# Altium schematic sheet 358MU&IZNWBYTU20260630.SchDoc
size 594 x 419 mm
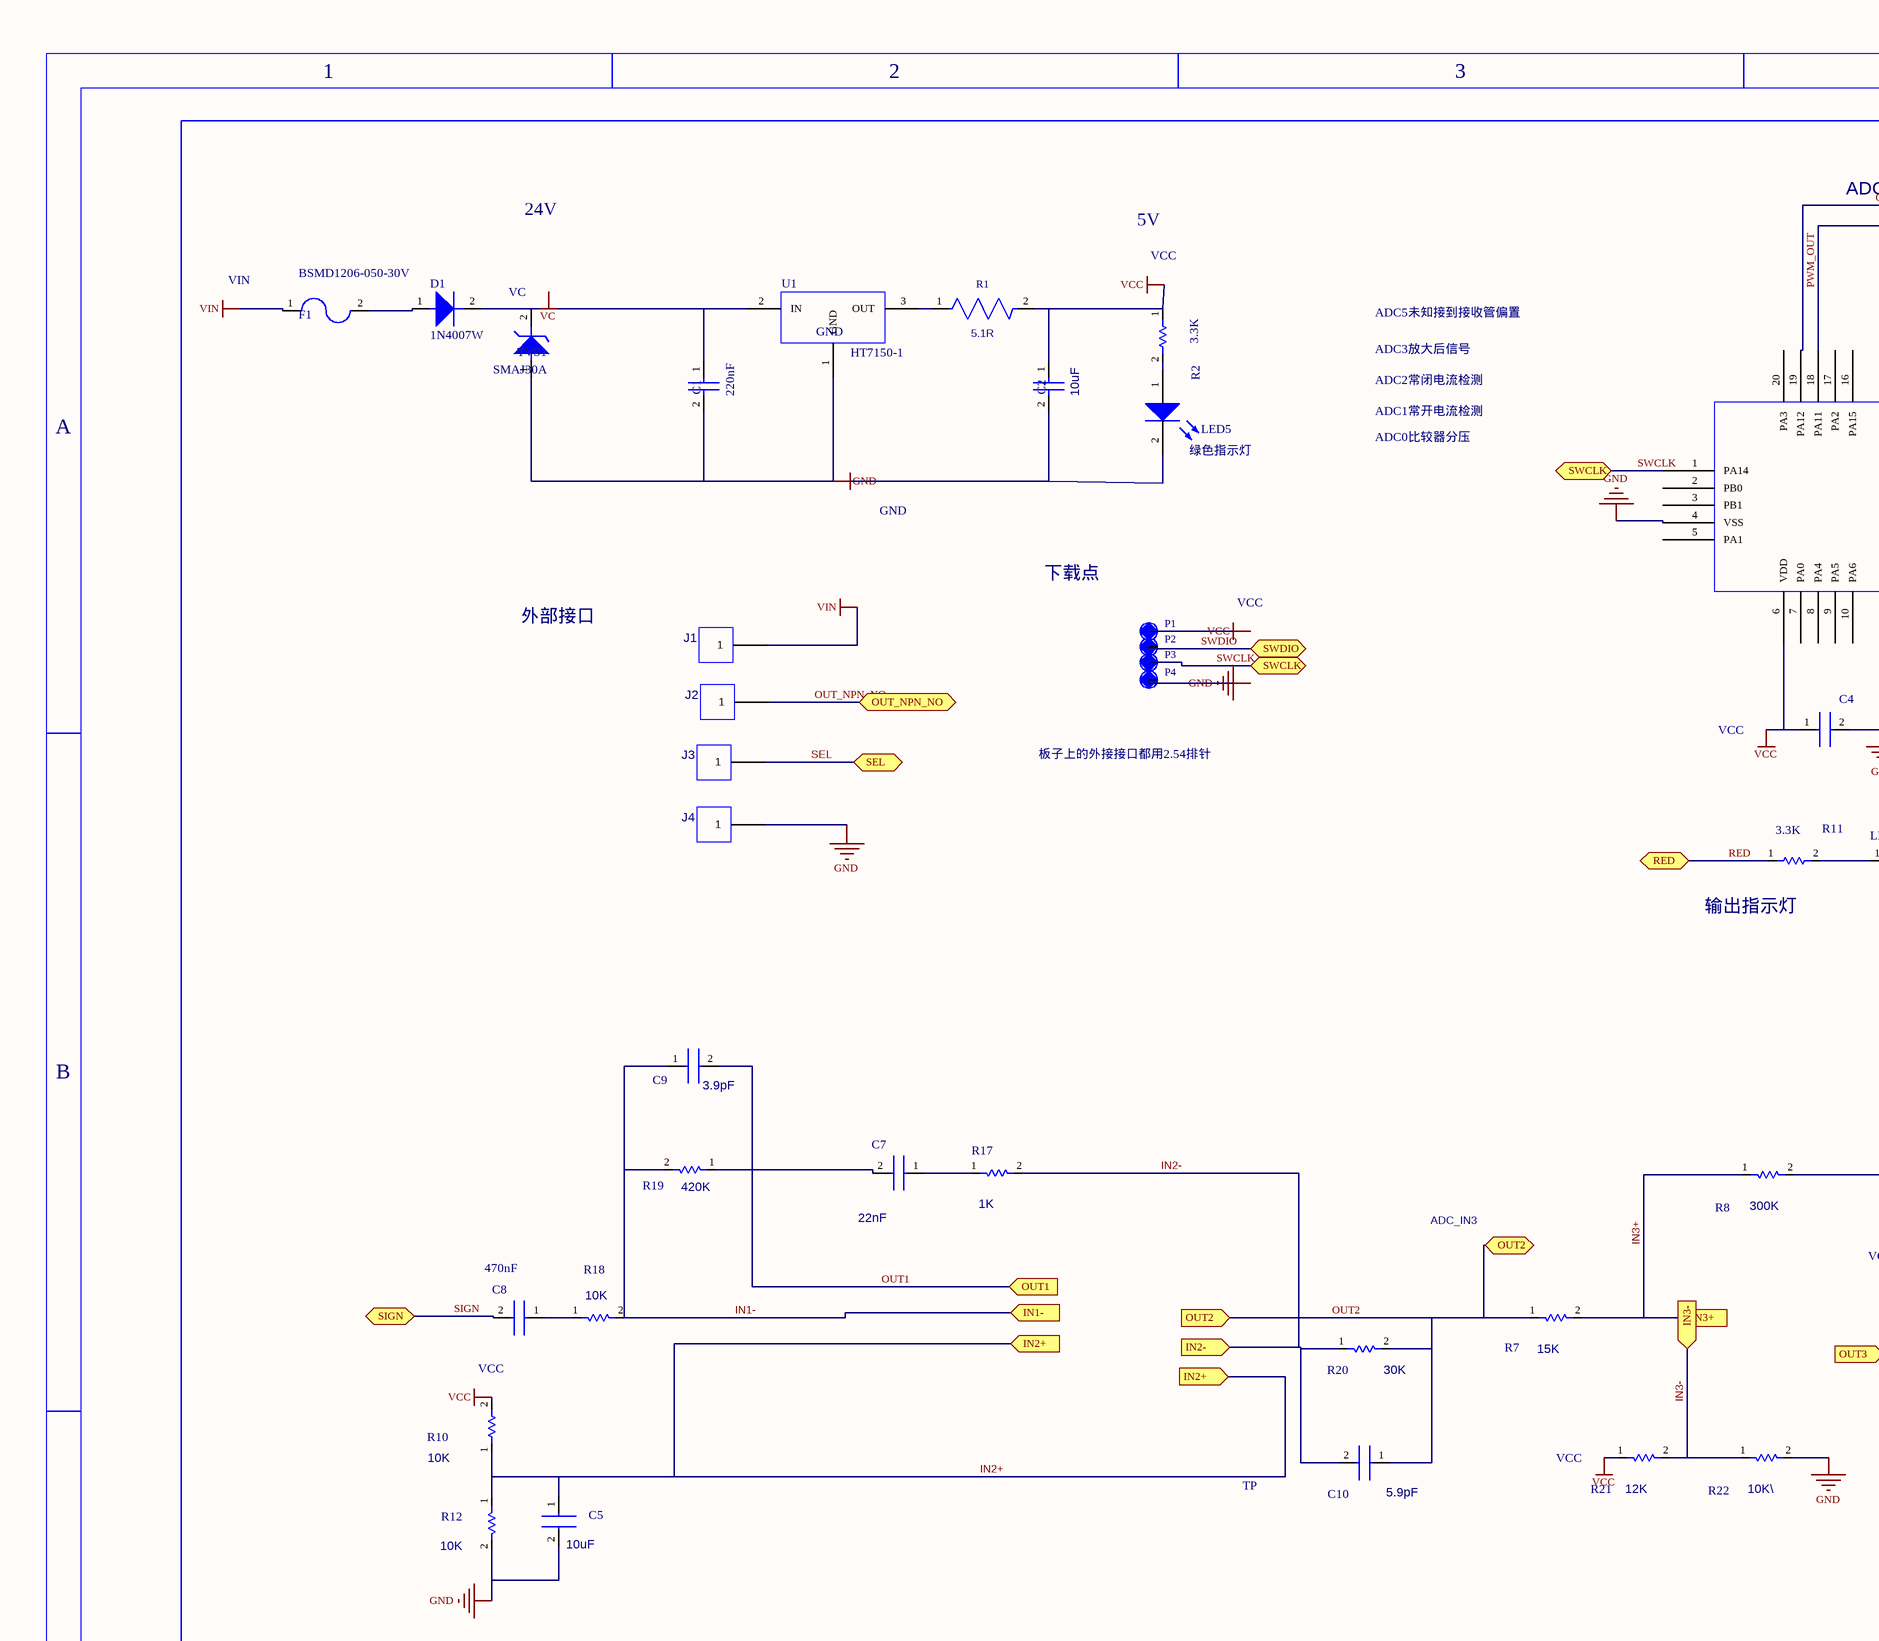
[diagram p0: 358MU&IZNWBYTU20260630.SchDoc, top left]
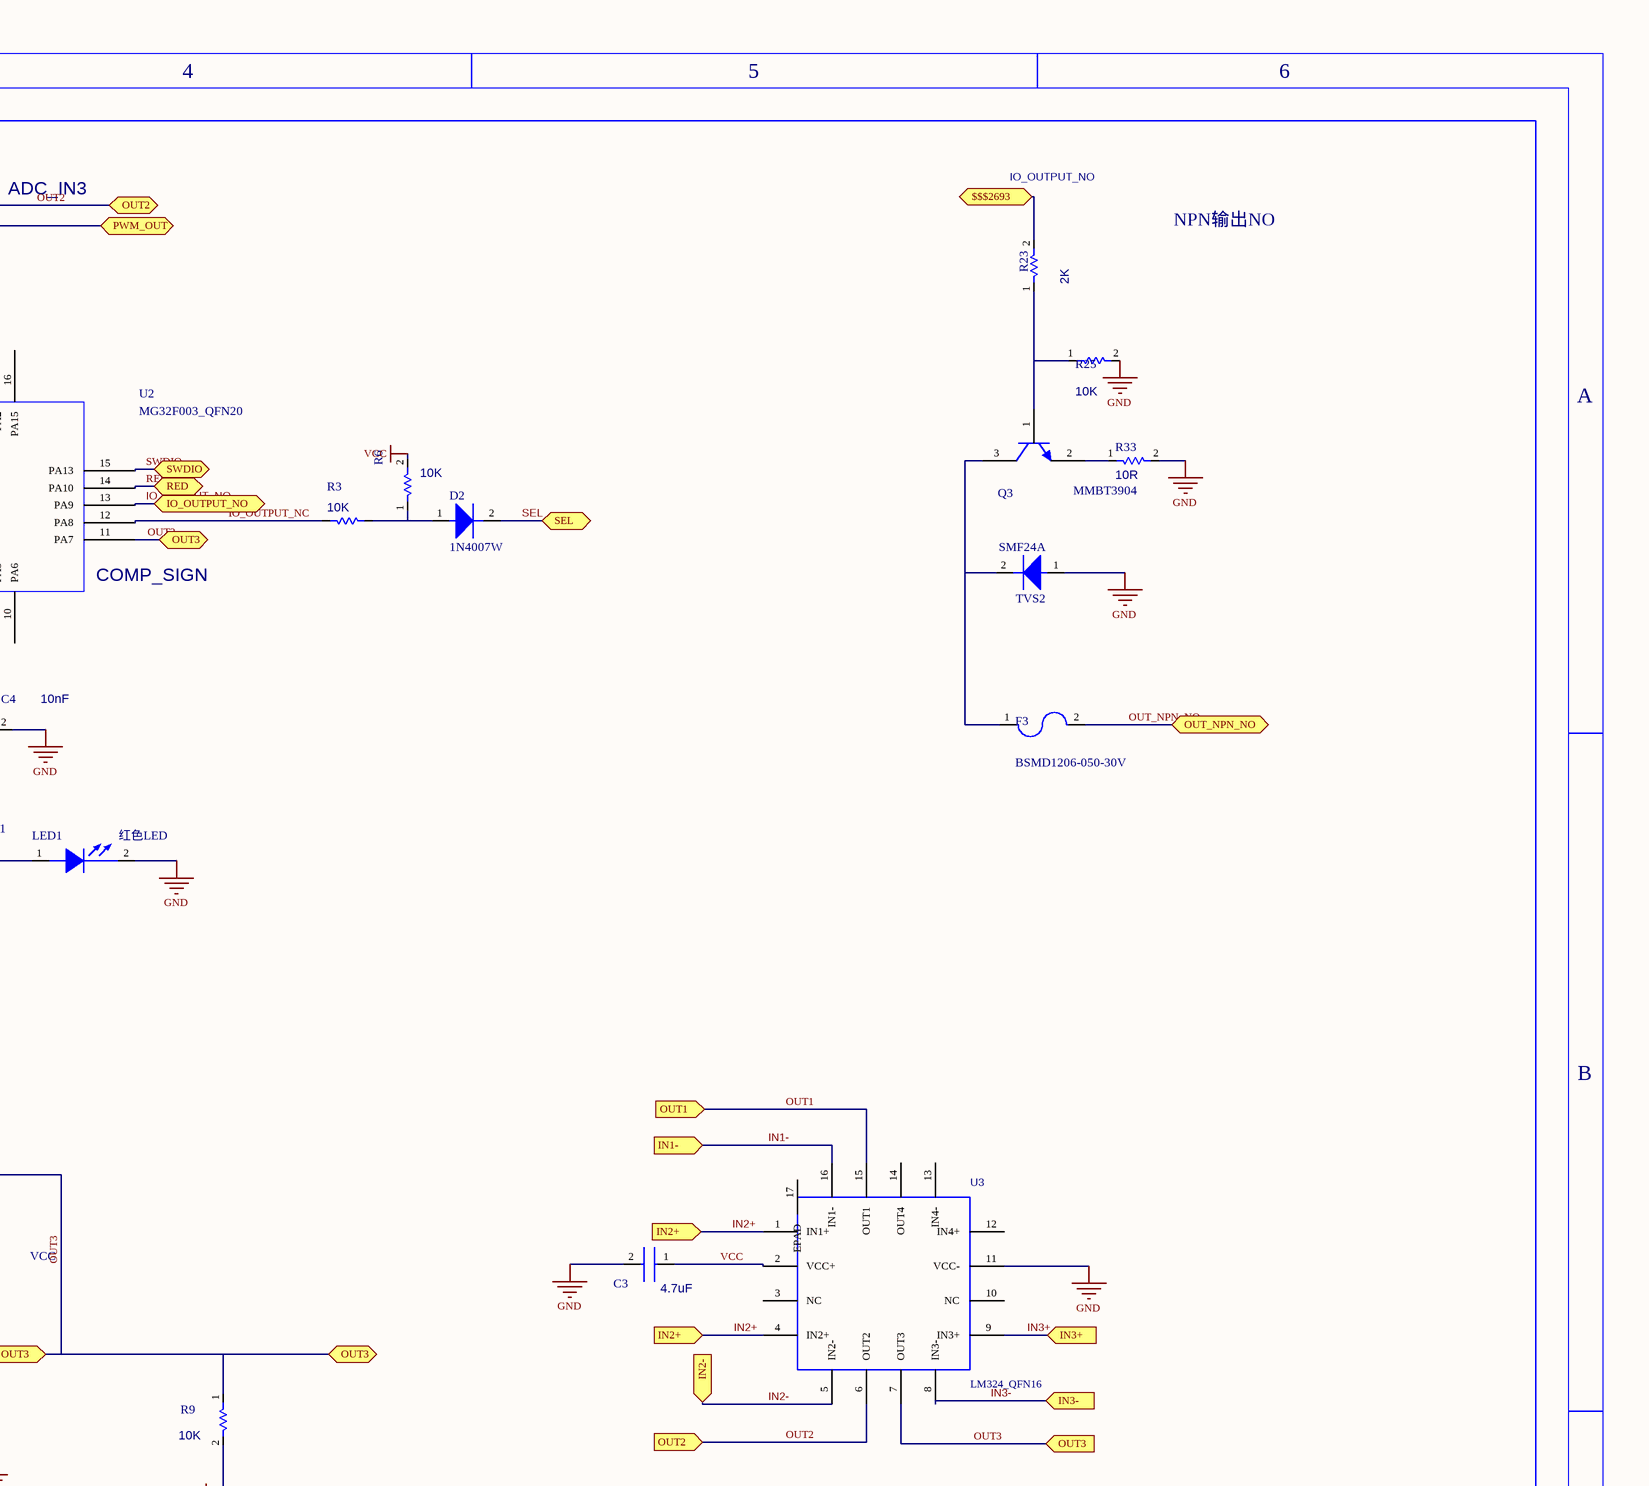
[diagram p1: 358MU&IZNWBYTU20260630.SchDoc, top right]
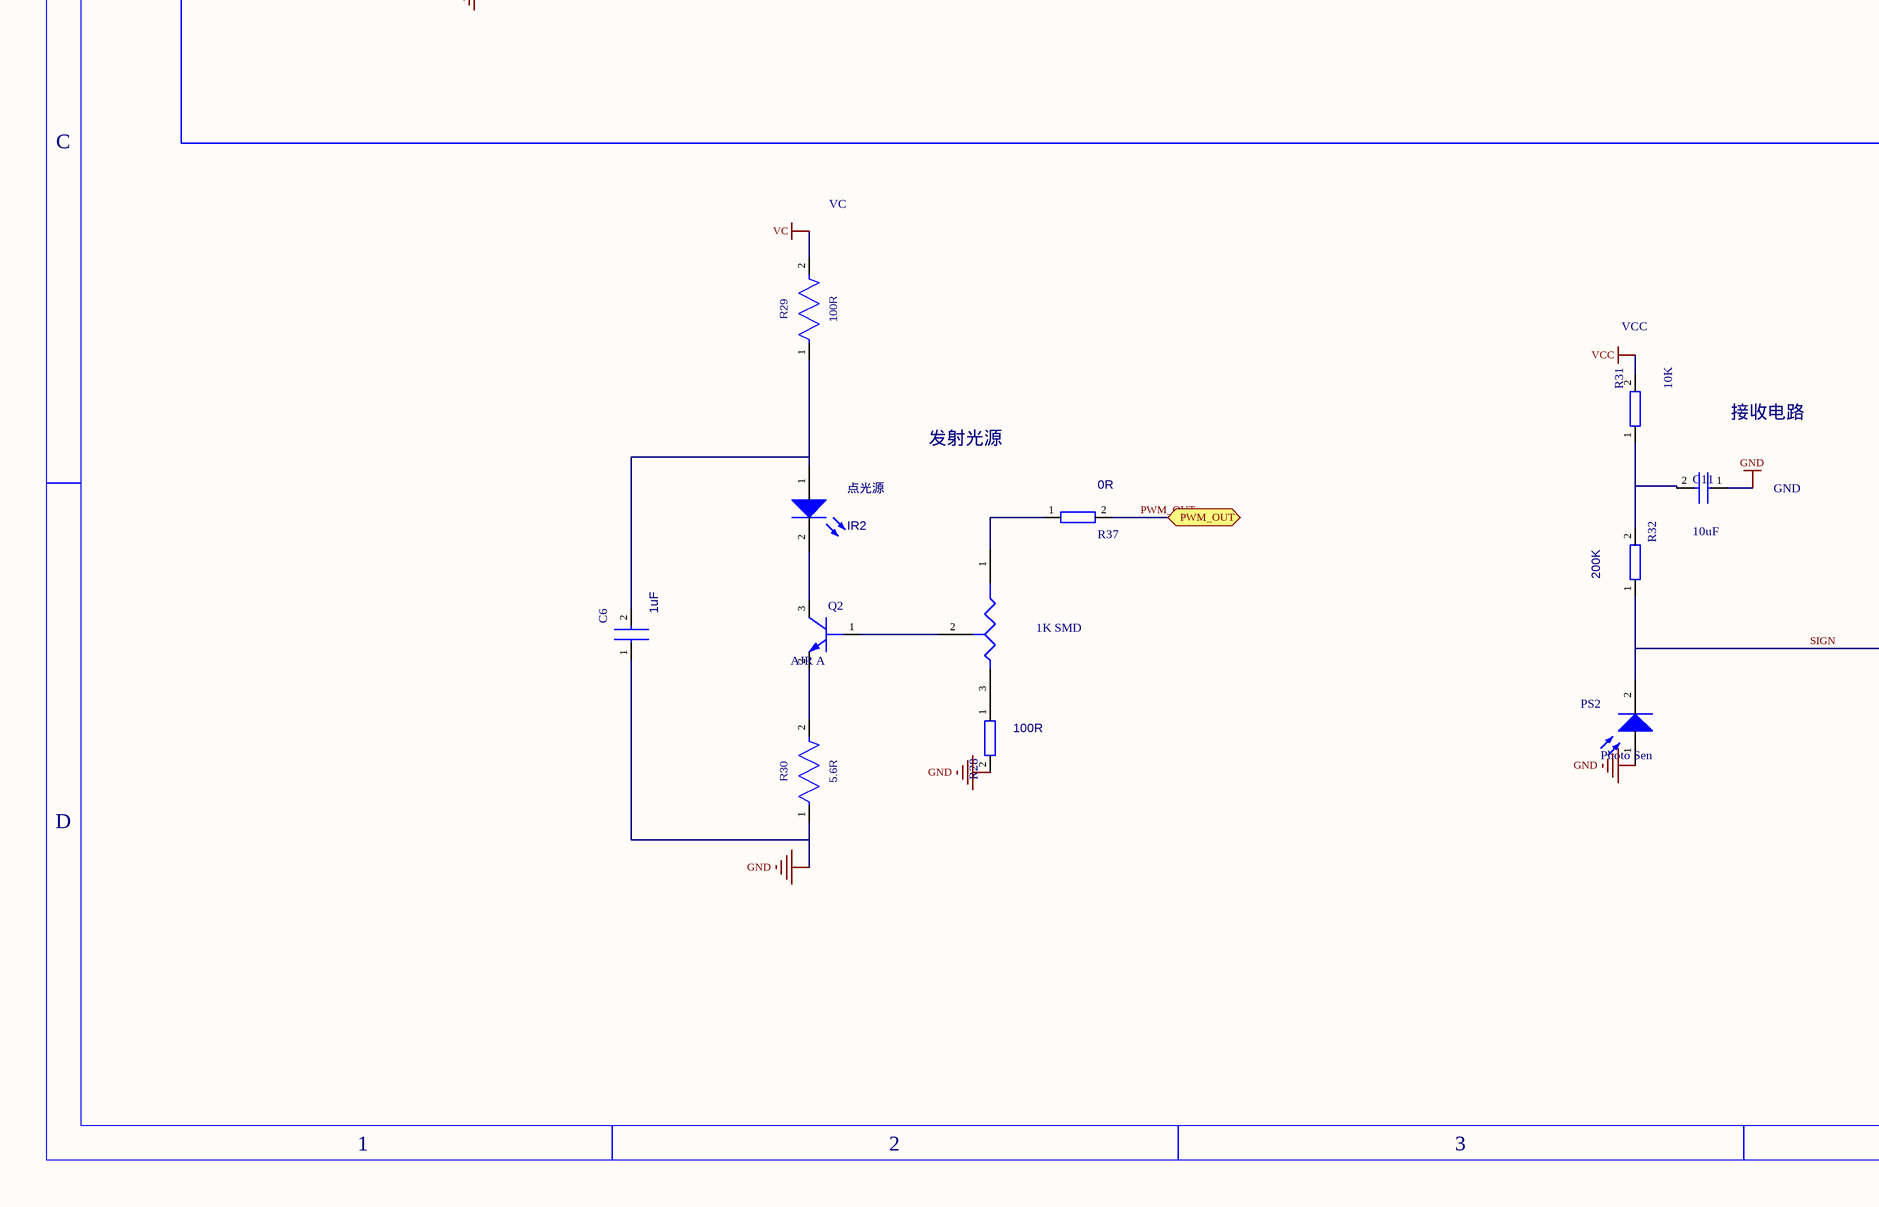
[diagram p2: 358MU&IZNWBYTU20260630.SchDoc, bottom left]
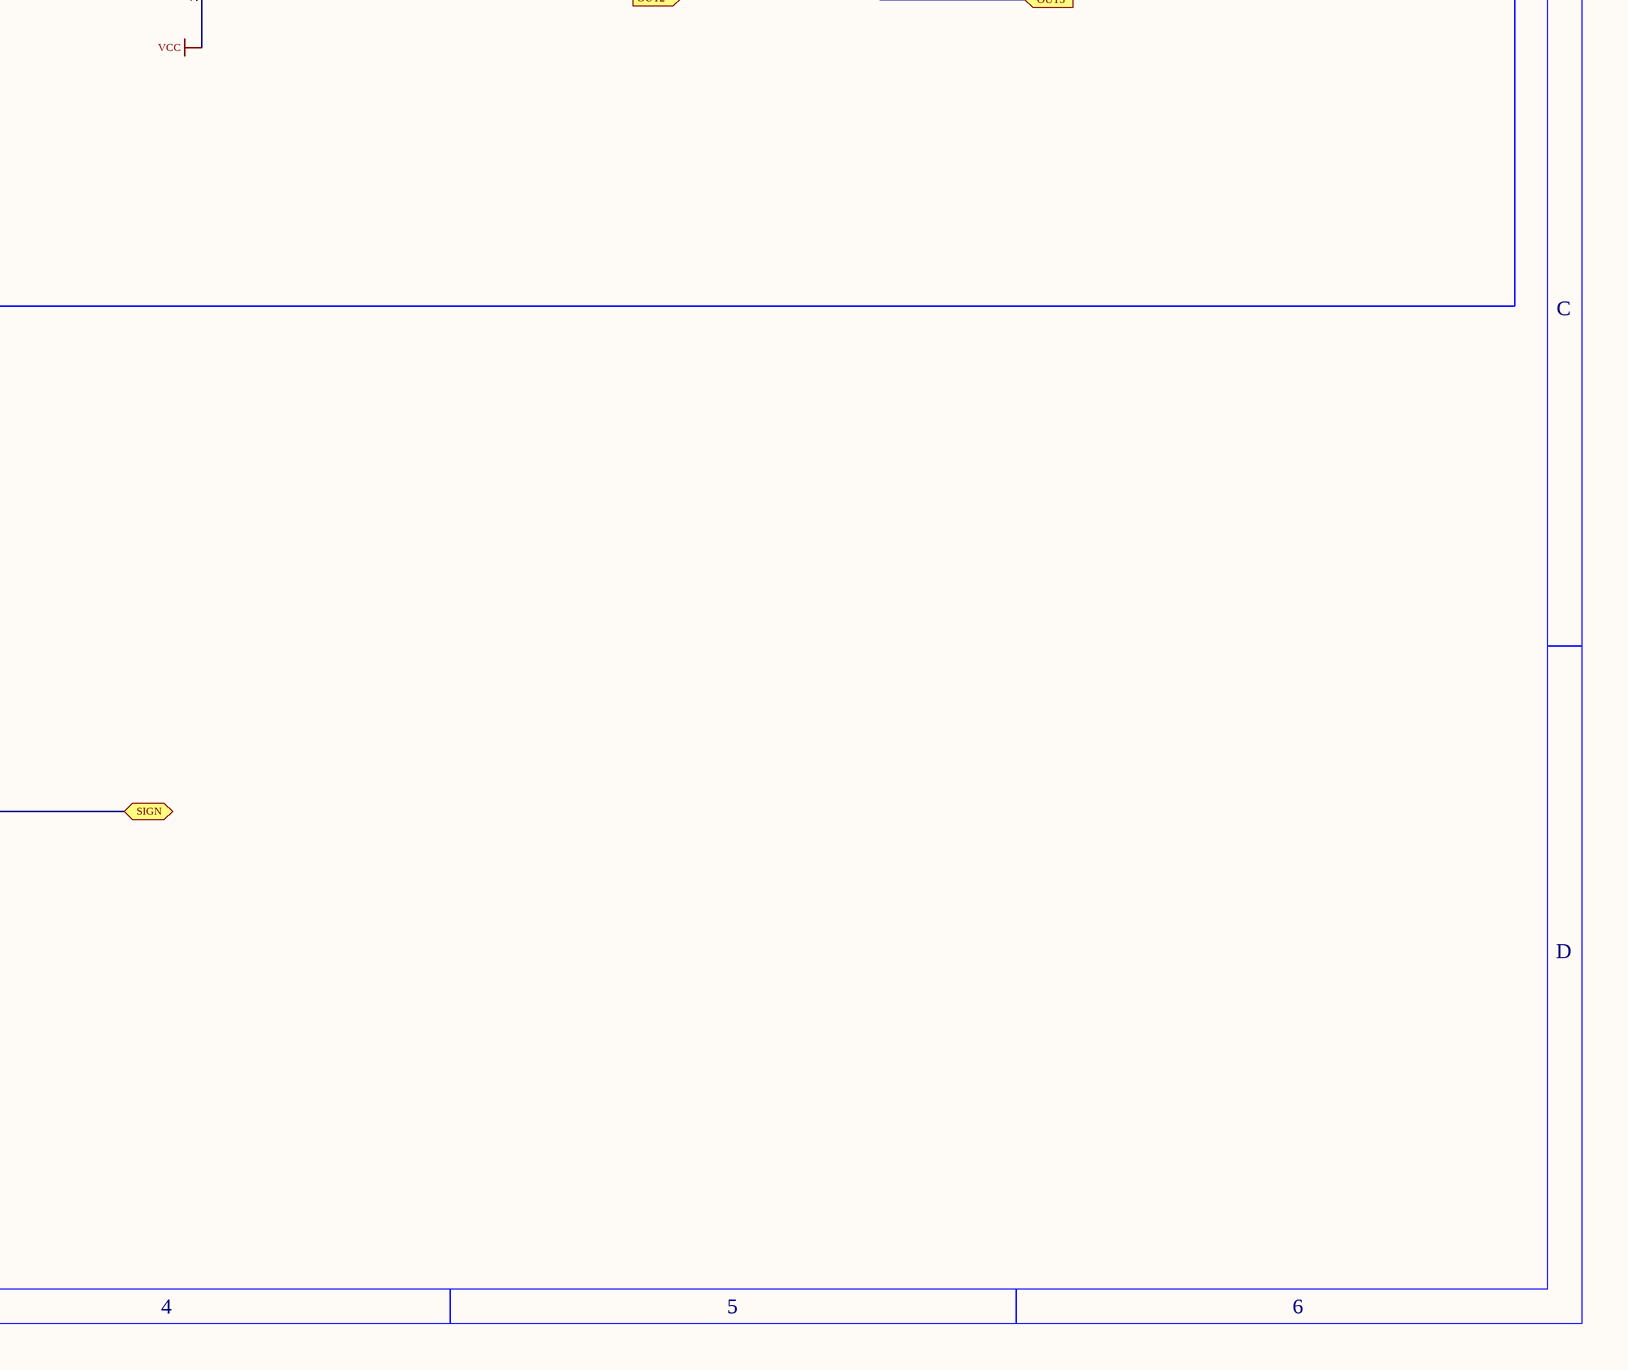
[diagram p3: 358MU&IZNWBYTU20260630.SchDoc, bottom right]

## Parts
C1  CAP  [C0603]  (value not drawn)
C2  CAP  [C0603]  (value not drawn)
C3  CAP_2  [C0603]  (value not drawn)
C4  CAP0402  [CC0402]  (value not drawn)
C5  CAP_2  [C0603]  (value not drawn)
C6  CAP0603  [0603C]  (value not drawn)
C7  CAP0402  [CC0402]  (value not drawn)
C8  CAP0402  [CC0402]  (value not drawn)
C9  CAP0402  [CC0402]  (value not drawn)
C10  CAP0402  [CC0402]  (value not drawn)
C11  CAP_NP  [0603]  (value not drawn)
D1  DIODE  [WSOD-323]  (value not drawn)
D2  DIODE  [WSOD-323]  (value not drawn)
F1  FUSE  [0603]  (value not drawn)
F3  FUSE  [0603]  (value not drawn)
IR2  LED0  [TXLED_SMD]  (value not drawn)
J1  FPAD_3C  [FPAD_3C]  (value not drawn)
J2  FPAD_3C  [FPAD_3C]  (value not drawn)
J3  FPAD_3C  [FPAD_3C]  (value not drawn)
J4  FPAD_3C  [FPAD_3C]  (value not drawn)
LED1  LED  [LED0603]  (value not drawn)
LED5  LED2  [LED0603]  (value not drawn)
P1  TEST_POINTB+  [TEST-POINT_D1.0]  (value not drawn)
P2  TEST_POINTB+  [TEST-POINT_D1.0]  (value not drawn)
P3  TEST_POINTB+  [TEST-POINT_D1.0]  (value not drawn)
P4  TEST_POINTB+  [TEST-POINT_D1.0]  (value not drawn)
PS2  PHOTO_SEN  [RXLED_SMD]  (value not drawn)
Q2  Q2N2369_0  [SOT23/2]  (value not drawn)
Q3  NPNSOT23  [SOT23/2]  (value not drawn)
R1  value 5.1R  [0603]  (hidden comment: RES0603)
R2  RAS0402  [R0402]  (value not drawn)
R3  RAS0402  [R0402]  (value not drawn)
R5  value 1K SMD  [SMD]  (hidden comment: ADJ_SMD)
R6  RAS0402  [R0402]  (value not drawn)
R7  RAS0402  [R0402]  (value not drawn)
R8  RAS0402  [R0402]  (value not drawn)
R9  RAS0402  [R0402]  (value not drawn)
R10  RAS0402  [R0402]  (value not drawn)
R11  RAS0402  [R0402]  (value not drawn)
R12  RAS0402  [R0402]  (value not drawn)
R17  RAS0402  [R0402]  (value not drawn)
R18  RAS0402  [R0402]  (value not drawn)
R19  RAS0402  [R0402]  (value not drawn)
R20  RAS0402  [R0402]  (value not drawn)
R21  RAS0402  [R0402]  (value not drawn)
R22  RAS0402  [R0402]  (value not drawn)
R23  RAS0402  [R0402]  (value not drawn)
R25  RAS0402  [R0402]  (value not drawn)
R28  RES  [R0603]  (value not drawn)
R29  value 100R  [0603]  (hidden comment: RES0603)
R30  value 5.6R  [0603]  (hidden comment: RES0603)
R31  R0402  [RES0402]  (value not drawn)
R32  R0402  [RES0402]  (value not drawn)
R33  RAS  [0603]  (value not drawn)
R37  R0402  [RES0402]  (value not drawn)
TVS1  DIODE_V  [SOD_523]  (value not drawn)
TVS2  SOD523  [SOD_523]  (value not drawn)
U1  HT7530-1  [SOT89]  (value not drawn)
U2  MG32F003-QFN20  [MG32F003_QFN20]  (value not drawn)
U3  LM324_QFN16  [LM324_QFN16]

## Ports
$$$2693 (bidir), IN1-, IN2+, IN2-, IN3+, IN3-, IO_OUTPUT_NO (bidir), OUT1, OUT2, OUT2 (bidir), OUT3, OUT3 (bidir), OUT_NPN_NO (bidir), PWM_OUT (bidir), RED (bidir), SEL (bidir), SIGN (bidir), SWCLK (bidir), SWDIO (bidir)

## Nets
GND: C1.2 C2.2 C3.2 C4.2 C5.2 C6.1 C11.1 J4.1 LED1.2(CATHODE) LED5.2(K) P4.1 PS2.1(A) R12.2 R22.2 R25.2 R28.2 R30.1 R33.2 TVS1.1 TVS2.1(A) U1.1(GND) U2.4(VSS) U3.11(VCC-)
VC: C1.1 D1.2(K) R29.2 TVS1.2 U1.2(IN)
VCC: C2.1 C3.1 C4.1 P1.1 R1.2 R2.1 R6.2 R9.2 R10.2 R21.1 R31.2 U2.6(VDD) U3.2(VCC+)
VIN: F1.1 J1.1
$$$2693: R23.2 ; port $$$2693
IN1-: C9.1 R18.2 R19.2 U3.16(IN1-) ; port IN1-
IN2+: C5.1 R10.1 R12.1 U3.1(IN1+) U3.4(IN2+) ; port IN2+
IN2-: C10.2 R17.2 R20.1 U3.5(IN2-) ; port IN2-
IN3+: R7.2 R8.1 U3.9(IN3+) ; port IN3+
IN3-: R21.2 R22.1 U3.8(IN3-) ; port IN3-
IO_OUTPUT_NC: R3.1 U2.12(PA8)
IO_OUTPUT_NO: U2.13(PA9) ; port IO_OUTPUT_NO
OUT1: C7.2 C9.2 R19.1 U3.15(OUT1) ; port OUT1
OUT2: C10.1 R7.1 R20.2 U2.19(PA12) U3.6(OUT2) ; port OUT2
OUT3: R8.2 R9.1 U2.11(PA7) U3.7(OUT3) ; port OUT3
OUT_NPN_NO: F3.2 J2.1 ; port OUT_NPN_NO
PWM_OUT: R37.2 U2.18(PA11) ; port PWM_OUT
RED: R11.1 U2.14(PA10) ; port RED
SEL: D2.2(K) J3.1 ; port SEL
SIGN: C8.2 PS2.2(K) R32.1 ; port SIGN
SWCLK: P3.1 U2.1(PA14) ; port SWCLK
SWDIO: P2.1 U2.15(PA13) ; port SWDIO
NetC6_2: C6.2 IR2.1(A) R29.1
NetC7_1: C7.1 R17.1
NetC8_1: C8.1 R18.1
NetC11_2: C11.2 R31.1 R32.2
NetD1_1: D1.1(A) F1.2
NetD2_1: D2.1(A) R3.2 R6.1
NetF3_1: F3.1 Q3.3(C) TVS2.2(K)
NetIR2_2: IR2.2(K) Q2.3(COLLECTOR)
NetLED1_1: LED1.1(ANODE) R11.2
NetLED5_1: LED5.1(A) R2.2
NetQ2_1: Q2.1(BASE) R5.2(TAP)
NetQ2_2: Q2.2(EMITTER) R30.2
NetQ3_1: Q3.1(B) R23.1 R25.1
NetQ3_2: Q3.2(E) R33.1
NetR1_1: R1.1 U1.3(OUT)
NetR5_1: R5.1(B) R37.1
NetR5_3: R5.3(A) R28.1

Not connected (* = marked no-connect by the designer): U2 2(PB0) 3(PB1) 5(PA1) 7(PA0) 8(PA4) 9(PA5) 10(PA6) 16(PA15) 17(PA2) 20(PA3); U3 3(NC) 10(NC) 12(IN4+) 13(IN4-) 14(OUT4) 17(EPAD)

## Notes on the sheet
- 1
- 2
- 3
- 4
- 5
- 6
- 24V
- ADC_IN3
- (near R23) IO_OUTPUT_NO
- (near F1) VIN
- (near TVS1) VC
- 5V
- (near R2) VCC
- NPN输出NO
- ADC2常闭电流检测
- ADC3放大后信号
- ADC5未知接到接收管偏置
- A
- ADC0比较器分压
- ADC1常开电流检测
- GND
- 外部接口
- 下载点
- VCC
- (near U2) COMP_SIGN
- 板子上的外接接口都用2.54排针
- (near R11) 输出指示灯
- B
- TP
- (near R21) VCC
- C
- (near R29) VC
- (near R31) VCC
- 接收电路
- 发射光源
- (near C11) GND
- D

## Library data of the parts
C1 C2 = CAP: 陶瓷电容; PCB DECAL: C0603
C4 C7-C10 = CAP0402: Capacitor; PCB DECAL: CC0402
C6 = CAP0603: Capacitor; Text_Field1: 20; Text_Field2: 10; PCB DECAL: 0603C
C11 = CAP_NP: Text_Field1: 20; Text_Field2: 10; PCB DECAL: 0603
IR2 = LED0: Typical INFRARED GaAs LED; Published: 8-Jun-2000; LatestRevisionDate: 08-Jul-2005; LatestRevisionNote: Mech Layer 1 removed.; PackageReference: LED-0; Publisher: Altium Limited; PackageDescription: LED; 2 Leads; PCB DECAL: TXLED_SMD
J1-J4 = FPAD_3C: Connector; PCB DECAL: FPAD_3C
LED1 = LED: Text_Field1: 40; Text_Field2: 20; PCB DECAL: LED0603
LED5 = LED2: Typical RED, GREEN, YELLOW, AMBER GaAs LED; Published: 8-Jun-2000; LatestRevisionDate: 17-Jul-2002; LatestRevisionNote: Re-released for DXP Platform.; PackageVersion: Feb-2002; PackageReference: 3.2X1.6X1.1; Publisher: Altium Limited; PackageDescription: SM LED; 2 Flat Leads; PCB DECAL: LED0603
PS2 = PHOTO_SEN: Photosensitive Diode; Published: 24-Mar-1999; LatestRevisionDate: 17-Jul-2002; LatestRevisionNote: Re-released for DXP Platform.; PackageReference: PIN2; Publisher: Altium Limited; PCB DECAL: RXLED_SMD
Q2 = Q2N2369_0: Text_Field1: 20; Text_Field2: 20; PCB DECAL: SOT23/2
Q3 = NPNSOT23: NPN Bipolar Transistor; Published: 8-Jun-2000; LatestRevisionDate: 17-Jul-2002; LatestRevisionNote: Re-released for DXP Platform.; PackageReference: TO-226-AA; Publisher: Altium Limited; PackageDescription: TO, Flat Index; 3 In-Line, Axial Leads; Body Dia. 4.8mm; Leads 0.55 x 0.51 mm (max); Code_JEDEC: TO-226-AA; PCB DECAL: SOT23/2
R1 R29 R30 = RES0603: SURFACE MOUNT RESISTOR 0.031 X 0.061 INCHES, 1/10W; Manufacturer #1: IPC SM-782 STD.; Sim.Analog.Order: Model$; Sim.Analog.Prefix: R; PCB DECAL: 0603
R5 = ADJ_SMD: Tapped Resistor; Sim_Note: Enter the Resistance value and the set point into parameter fields.; Set_Position: 0.5; Published: 24-Mar-1999; LatestRevisionDate: 17-Jul-2002; LatestRevisionNote: Re-released for DXP Platform.; PackageReference: VR3; Publisher: Altium Limited; PackageDescription: Variable Resistor, Thru-Hole; 3 Leads; PCB DECAL: SMD
R31 R32 = R0402: Text_Field1: 20; Text_Field2: 30; Geometry.Height: 0.4; Value: 1K; PCB DECAL: RES0402
R37 = R0402: Geometry.Height: 0.4; Value: 1K; PCB DECAL: RES0402
TVS1 = DIODE_V: Varactor Diode; PCB DECAL: SOD_523
TVS2 = SOD523: Diode; Published: 12-Feb-2010; DatasheetVersion: Rev.3.00, May-2003; PackageVersion: Aug-2005; PackageReference: GLZZ0002ZA-A; Publisher: Altium Limited; PackageDescription: Metal Electrode Face (MELF) Diode; Body 3.5 x 1.35 mm (LxDia); ComponentLink1Description: Manufacturer Link; ComponentLink1URL: http://sg.renesas.com/fmwk.jsp?cnt=diode_landing.jsp&fp=/products/discrete/diodes/; ComponentLink2Description: Datasheet; ComponentLink2URL: http://documentation.renesas.com/eng/products/diode/rej03g0018_hzk.pdf; ComponentLink3Description: Packaging Specification; ComponentLink3URL: http://sg.renesas.com/media/products/common_info/package/pdf/diode/code/glzz0002za_a.pdf; PCB DECAL: SOD_523
U1 = HT7530-1: 3.0V 100mA Low Power,  Low Dropout Voltage (LDO) Regulator; Published: 30-Mar-2007; DatasheetVersion: rev1.50, Jan-2006; PackageVersion: Jan-2006; PackageReference: SOT-89; Publisher: Altium Limited; PackageDescription: 3-Pin SOT-89 Package 1.5 mm Pitch, 4.1 mm Lead Span; Code_IPC: SOT89; ComponentLink1Description: Manufacturer Link; ComponentLink1URL: http://www.holtek.com/; ComponentLink2Description: Datasheet; ComponentLink2URL: http://www.holtek.com/pdf/consumer/75xx_1v150.pdf; PCB DECAL: SOT89
U2 = MG32F003-QFN20: QFN20主控芯片; PCB DECAL: MG32F003_QFN20
C3 C5 = CAP_2: PCB DECAL: C0603
D1 D2 = DIODE: Description: Diode; PCB DECAL: WSOD-323
F1 F3 = FUSE: Description: Fuse; PCB DECAL: 0603
P1-P4 = TEST_POINTB+: PCB DECAL: TEST-POINT_D1.0
R2 R3 R6-R12 R17-R23 R25 = RAS0402: PCB DECAL: R0402
R28 = RES: PCB DECAL: R0603
R33 = RAS: PCB DECAL: 0603
U3 = LM324_QFN16: PCB DECAL: LM324_QFN16